# EasyEDA schematic PYZ_Reaktor.json
TITLE: Sheet_1; REV: 1.0; Date: 2025-04-23; Sheet: 1/1; Company: Your Company
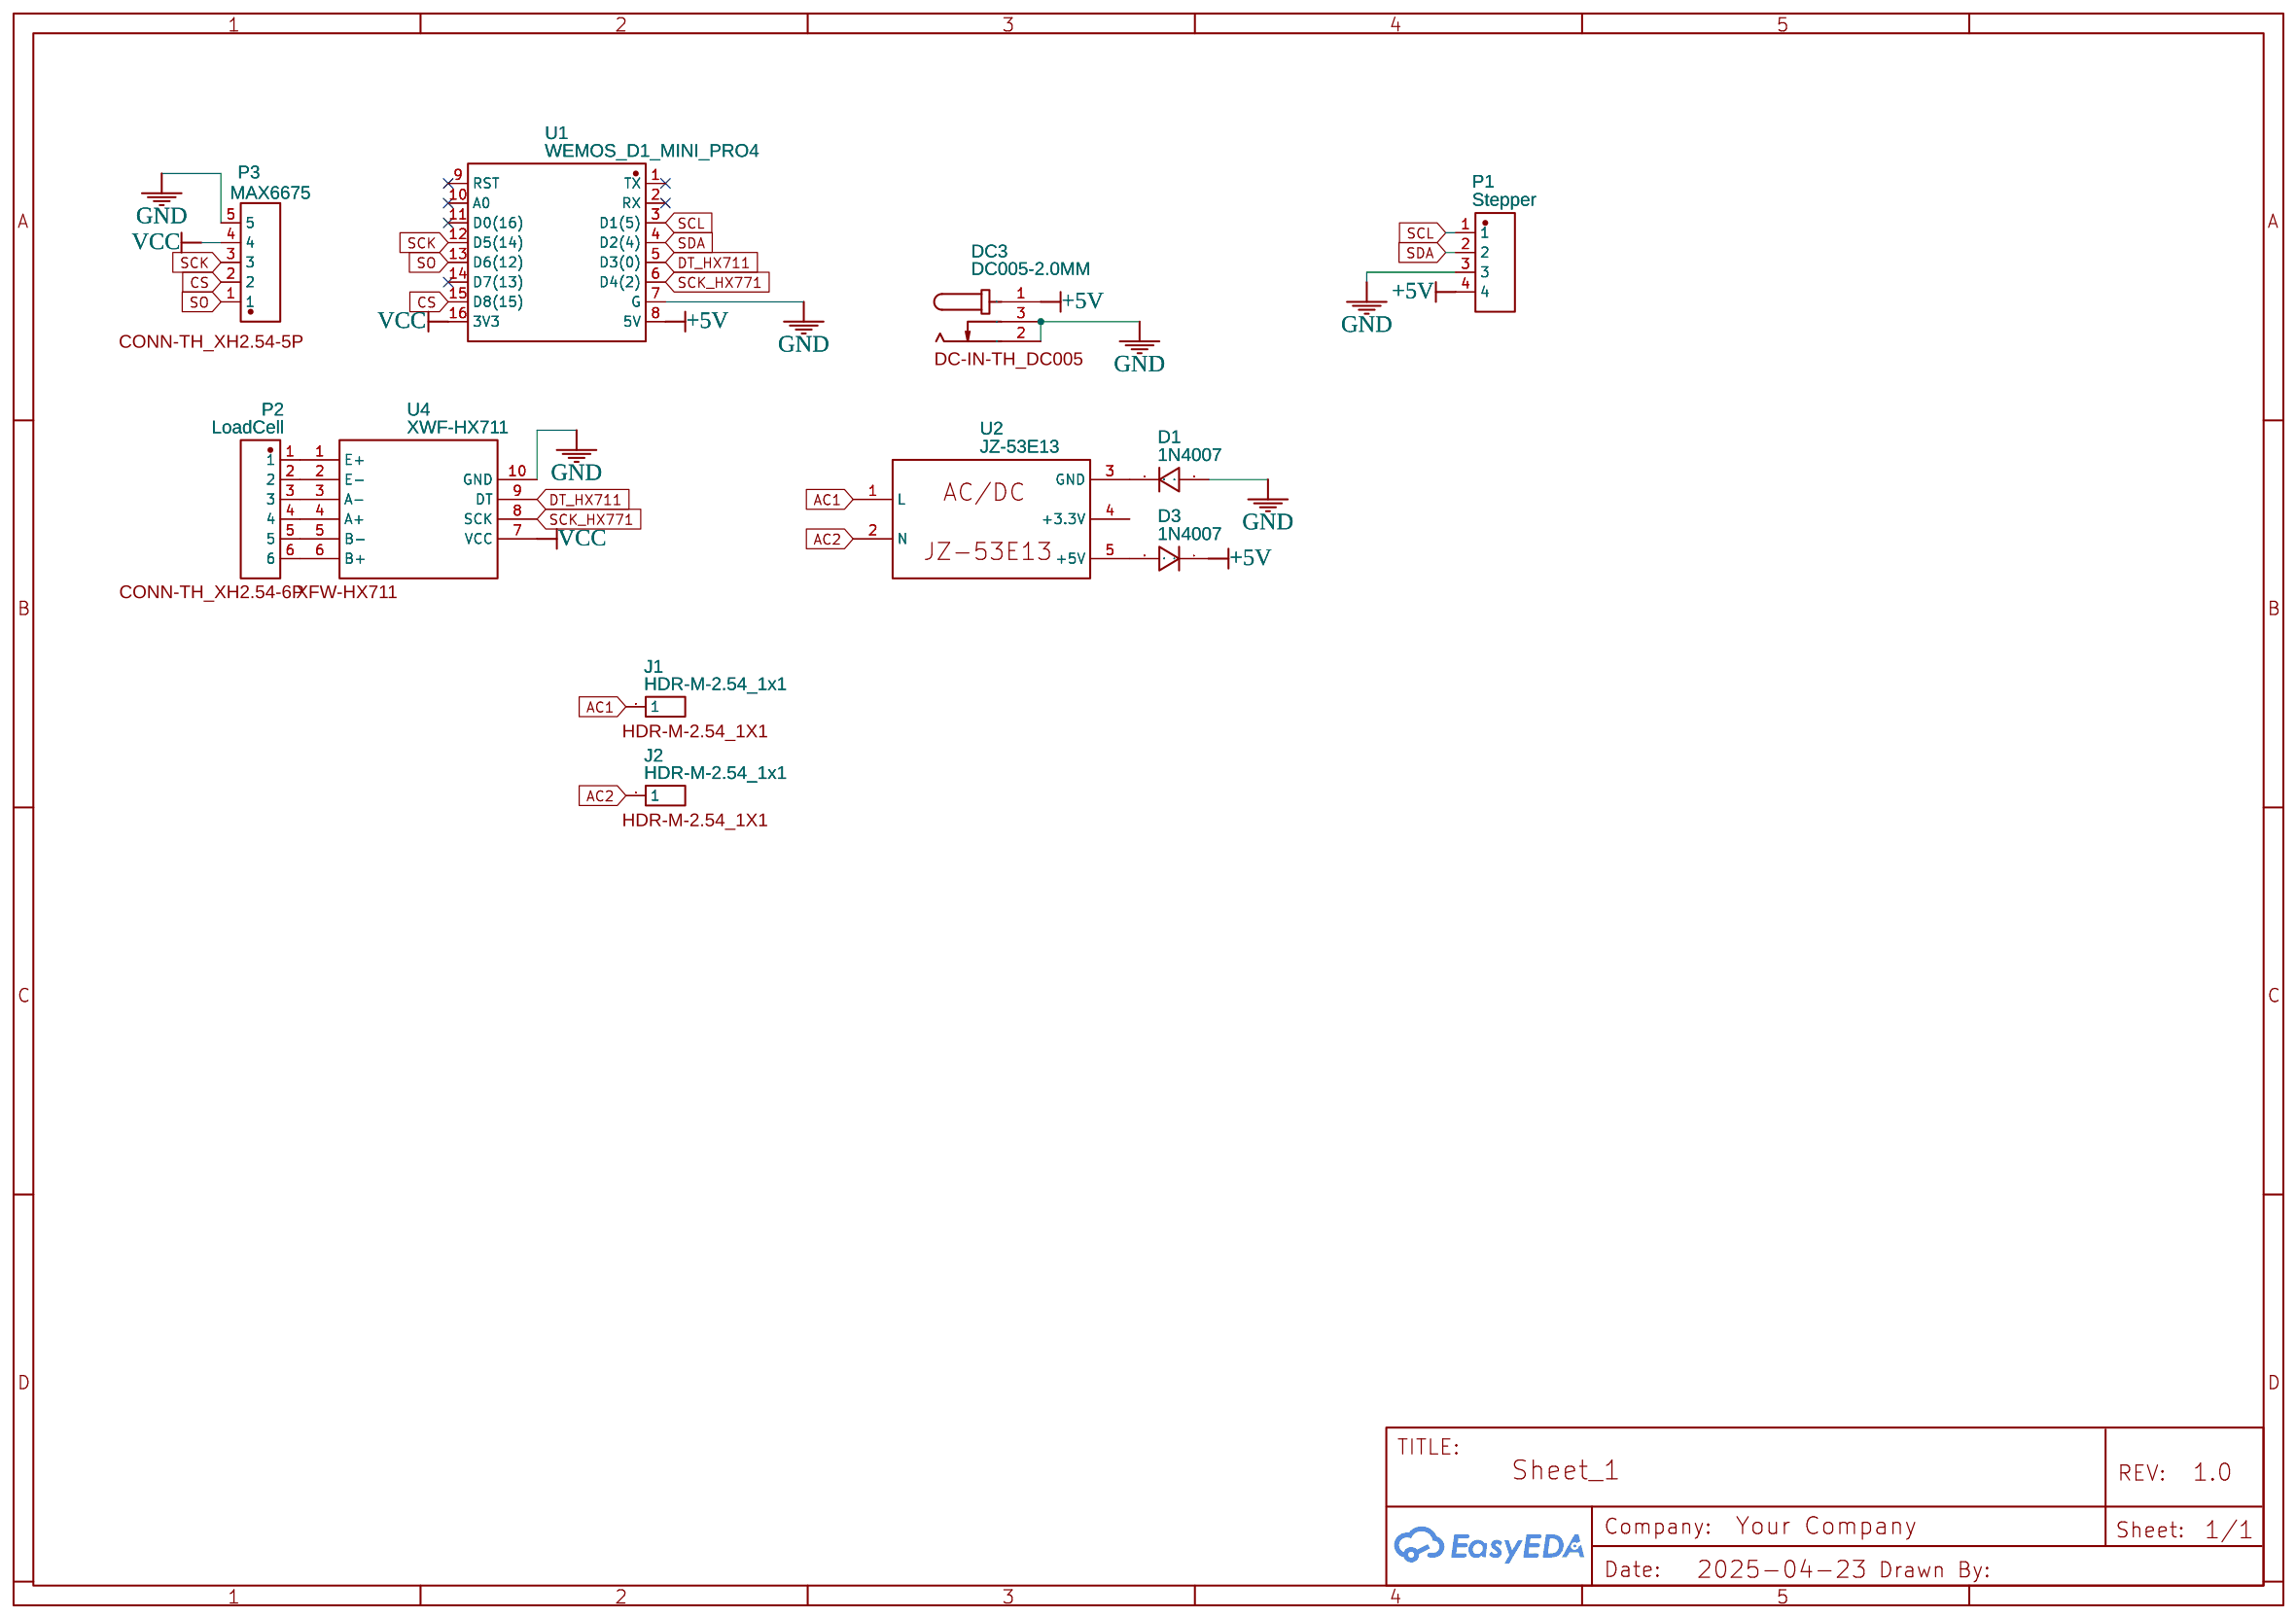
[diagram p0: schematic sheet]

## Parts
D1  1N4007  [DO-41_BD2.4-L4.7-P8.70-D0.9-RD]
D3  1N4007  [DO-41_BD2.4-L4.7-P8.70-D0.9-RD]
DC3  DC005-2.0MM  [DC-IN-TH_DC005]
J1  HDR-M-2.54_1x1  [HDR-M-2.54_1X1]
J2  HDR-M-2.54_1x1  [HDR-M-2.54_1X1]
P1  Stepper  [CONN-TH_4P-P2.50-XH2.54-4P]
P2  LoadCell  [CONN-TH_XH2.54-6P]
P3  MAX6675  [CONN-TH_XH2.54-5P]
U1  WEMOS_D1_MINI_PRO4  [DIP-16_WEMOS_D1_MINI_PRO4]
U2  JZ-53E13  [JZ-53E13]
U4  XWF-HX711  [XFW-HX711]

## Library data of the parts
D1 D3 = 1N4007: Supplier: LCSC; Manufacturer: SEMTECH; Supplier Part: C106903; Contributor: LCEDA_Lib; Package Display: No
DC3 = DC005-2.0MM: Supplier: LCSC; Manufacturer: SOFNG; Supplier Part: C111567; Package Display: Yes
J1 J2 = HDR-M-2.54_1x1: Supplier Part: C81276; Supplier: LCSC; Contributor: LCEDA_Lib; Package Display: Yes
P1 = XH-2.54-4P: Contributor: LCSC; Supplier: LCSC; Supplier Part: C9900003933; Manufacturer: null; Package Display: No
P2 = 02.XH2.54-6P: Contributor: LCSC; Supplier: LCSC; Supplier Part: C9900000754; Manufacturer: null; Manufacturer Part: XH2.54-6P 直插; JLCPCB Part Class: Extended Part; Package Display: Yes
P3 = XH-2.54-5P: Contributor: LCSC; Supplier: LCSC; Supplier Part: C9900003918; Manufacturer: null; Package Display: Yes
U1 = WEMOS_D1_MINI_PRO4: Contributor: LCSC; Supplier: LCSC; Supplier Part: C2837266; Manufacturer: null; Manufacturer Part: Wemos_D1_mini_Pro4; JLCPCB Part Class: Extended Part; Package Display: No
U2 = JZ-53E13: Contributor: berk11
U4 = XWF-HX711: Contributor: C.M ABEYSINGHE; Package Display: Yes

## Nets
+5V: D3.1 DC3.1 P1.4 U1.8(5V)
GND: D1.2 DC3.2 DC3.3 P1.3 P3.5 U1.7(G) U4.10(GND)
VCC: P3.4 U1.16(3V3) U4.7(VCC)
AC1: J1.1 U2.1(L)
AC2: J2.1 U2.2(N)
CS: P3.2 U1.15(D8(15))
DT_HX711: U1.5(D3(0)) U4.9(DT)
SCK: P3.3 U1.12(D5(14))
SCK_HX771: U1.6(D4(2)) U4.8(SCK)
SCL: P1.1 U1.3(D1(5))
SDA: P1.2 U1.4(D2(4))
SO: P3.1 U1.13(D6(12))
Net-(D1-1): D1.1 U2.3(GND)
Net-(D3-2): D3.2 U2.5(+5V)
Net-(P2-1): P2.1 U4.1(E+)
Net-(P2-2): P2.2 U4.2(E-)
Net-(P2-3): P2.3 U4.3(A-)
Net-(P2-4): P2.4 U4.4(A+)
Net-(P2-5): P2.5 U4.5(B-)
Net-(P2-6): P2.6 U4.6(B+)

Not connected (* = marked no-connect by the designer): U1 1(TX)* 2(RX)* 9(RST)* 10(A0)* 11(D0(16))* 14(D7(13))*; U2 4(+3.3V)
